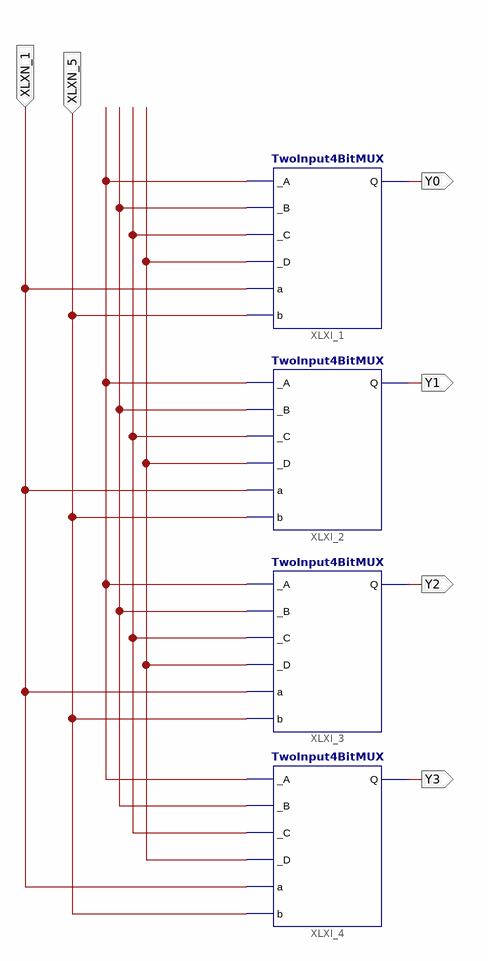
[diagram p0: schematic sheet 1]
// Xilinx ISE schematic FourBitMux.sch (spartan3e) as structural Verilog: 4 symbols, 6 ports
module FourBitMux (
  input  XLXN_1,
  input  XLXN_5,
  output Y0,
  output Y1,
  output Y2,
  output Y3
);

  wire XLXN_10, XLXN_12, XLXN_13, XLXN_15;

  TwoInput4BitMUX XLXI_1 (._A(XLXN_10), ._B(XLXN_12), ._C(XLXN_13), ._D(XLXN_15), .a(XLXN_1), .b(XLXN_5), .Q(Y0));
  TwoInput4BitMUX XLXI_2 (._A(XLXN_10), ._B(XLXN_12), ._C(XLXN_13), ._D(XLXN_15), .a(XLXN_1), .b(XLXN_5), .Q(Y1));
  TwoInput4BitMUX XLXI_3 (._A(XLXN_10), ._B(XLXN_12), ._C(XLXN_13), ._D(XLXN_15), .a(XLXN_1), .b(XLXN_5), .Q(Y2));
  TwoInput4BitMUX XLXI_4 (._A(XLXN_10), ._B(XLXN_12), ._C(XLXN_13), ._D(XLXN_15), .a(XLXN_1), .b(XLXN_5), .Q(Y3));
endmodule
